# EAGLE design Microinverter (EAGLE 9.5.2)
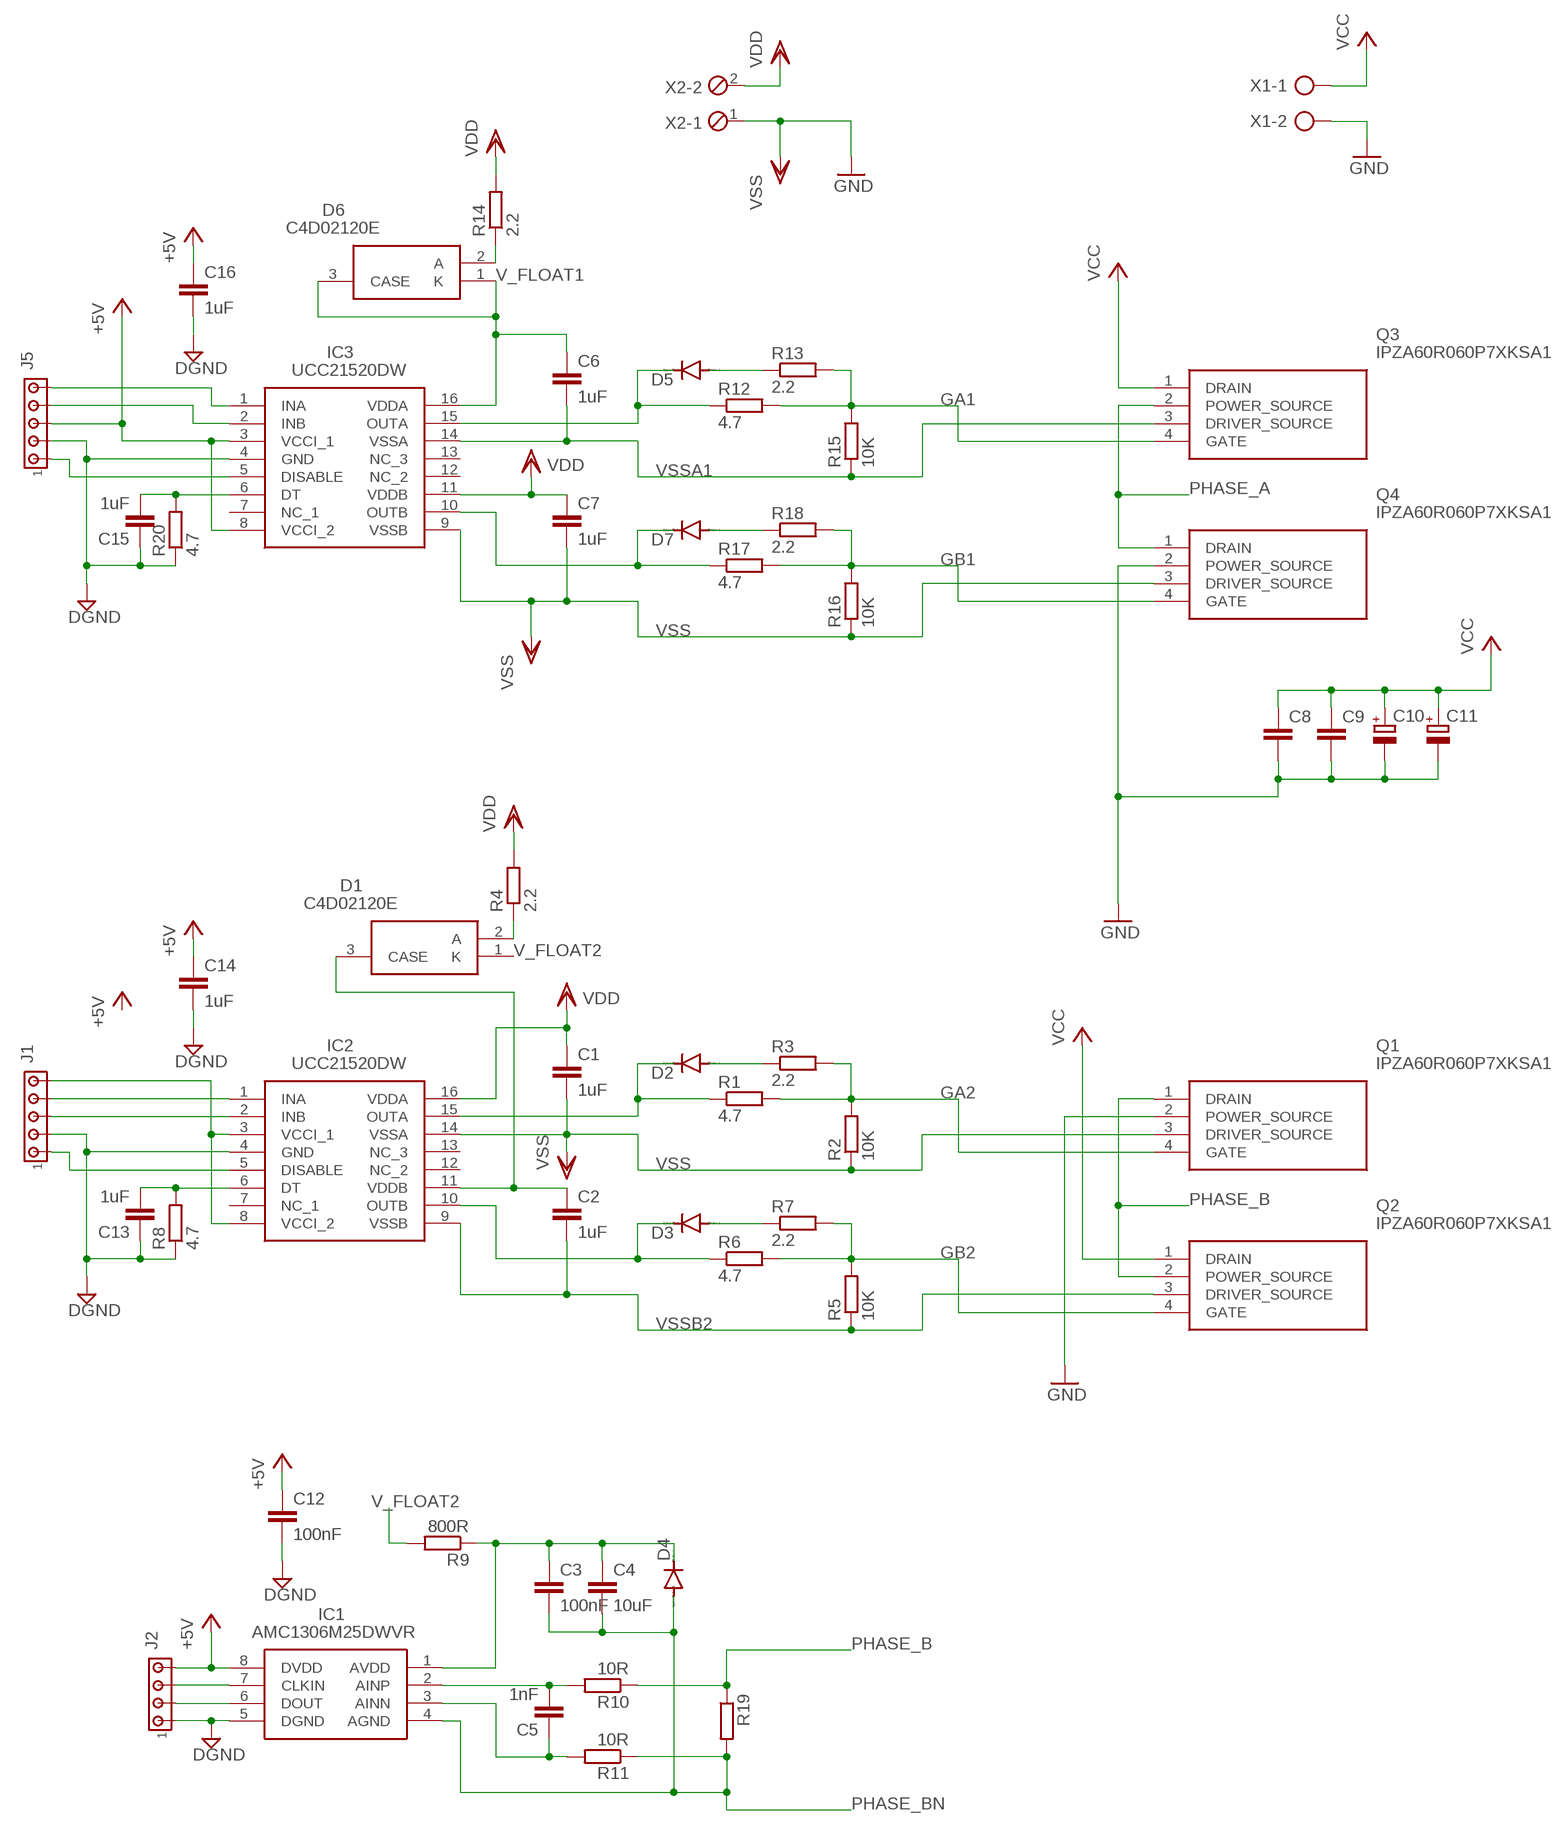
[diagram p0: schematic, sheet 1]

## Parts
C1  1uF  C-EUC0805  [C0805]
C2  1uF  C-EUC0805  [C0805]
C3  100nF  C-EUC0805  [C0805]
C4  10uF  C-EUC0805  [C0805]
C5  1nF  C-EUC0805  [C0805]
C6  1uF  C-EUC0805  [C0805]
C7  1uF  C-EUC0805  [C0805]
C8  C-EUC1210K  [C1210K]
C9  C-EUC1210K  [C1210K]
C10  CPOL-EUSANYO_H  [SANYO-OSCON_H]
C11  CPOL-EUSANYO_H  [SANYO-OSCON_H]
C12  100nF  C-EUC0805  [C0805]
C13  1uF  C-EUC0805  [C0805]
C14  1uF  C-EUC0805  [C0805]
C15  1uF  C-EUC0805  [C0805]
C16  1uF  C-EUC0805  [C0805]
D1  C4D02120E  [C3D06065E]
D2  MBR0520LT  [SOD123]
D3  MBR0520LT  [SOD123]
D4  MBR0520LT  [SOD123]
D5  MBR0520LT  [SOD123]
D6  C4D02120E  [C3D06065E]
D7  MBR0520LT  [SOD123]
IC1  AMC1306M25DWVR  [SOIC127P1150X280-8N]
IC2  UCC21520DW  [SOIC127P1030X265-16N]
IC3  UCC21520DW  [SOIC127P1030X265-16N]
J1  MTA05-100  [10X05MTA]
J2  MTA04-100  [10X04MTA]
J5  MTA05-100  [10X05MTA]
Q1  IPZA60R060P7XKSA1  [IPZA60R060P7XKSA1]
Q2  IPZA60R060P7XKSA1  [IPZA60R060P7XKSA1]
Q3  IPZA60R060P7XKSA1  [IPZA60R060P7XKSA1]
Q4  IPZA60R060P7XKSA1  [IPZA60R060P7XKSA1]
R1  4.7  R-EU_R0805  [R0805]
R2  10K  R-EU_R0805  [R0805]
R3  2.2  R-EU_R0805  [R0805]
R4  2.2  R-EU_R0805  [R0805]
R5  10K  R-EU_R0805  [R0805]
R6  4.7  R-EU_R0805  [R0805]
R7  2.2  R-EU_R0805  [R0805]
R8  4.7  R-EU_R0805  [R0805]
R9  800R  R-EU_R0805  [R0805]
R10  10R  R-EU_R0805  [R0805]
R11  10R  R-EU_R0805  [R0805]
R12  4.7  R-EU_R0805  [R0805]
R13  2.2  R-EU_R0805  [R0805]
R14  2.2  R-EU_R0805  [R0805]
R15  10K  R-EU_R0805  [R0805]
R16  10K  R-EU_R0805  [R0805]
R17  4.7  R-EU_R0805  [R0805]
R18  2.2  R-EU_R0805  [R0805]
R19  R-EU_R2512  [R2512]
R20  4.7  R-EU_R0805  [R0805]
X1  AK500/2  [AK500/2]
X2  MPT2  [2POL254]

## Nets
+5V: C12.1 C14.1 C16.1 IC1.8(DVDD) IC3.3(VCCI_1) IC3.8(VCCI_2) J2.4 J5.3
AVDD: C3.1 C4.1 D4.C IC1.1(AVDD) R9.1
CLKIN: IC1.7(CLKIN) J2.3
DGND: C12.2 C13.1 C14.2 C15.1 C16.2 IC1.5(DGND) IC2.4(GND) IC3.4(GND) J1.2 J2.1 J5.2 R8.1 R20.1
DOUT: IC1.6(DOUT) J2.2
GA1: Q3.4(GATE) R12.2 R13.2 R15.2
GA2: Q1.4(GATE) R1.2 R2.2 R3.2
GB1: Q4.4(GATE) R16.2 R17.2 R18.2
GB2: Q2.4(GATE) R5.2 R6.2 R7.2
GND: C8.2 C9.2 C10.- C11.- Q1.2(POWER_SOURCE) Q4.2(POWER_SOURCE) X1.2
N$1: D2.A R3.1
N$2: D3.A R7.1
N$3: C5.2 IC1.2(AINP) R10.2
N$4: D6.2(A) R14.1
N$5: D5.A R13.1
N$6: D7.A R18.1
N$7: D1.2(A) R4.1
N$8: C5.1 IC1.3(AINN) R11.2
N$9: IC2.1(INA) J1.4
N$10: C13.2 IC2.6(DT) R8.2
N$11: IC2.2(INB) J1.3
N$12: IC2.5(DISABLE) J1.1
N$13: C15.2 IC3.6(DT) R20.2
N$15: IC3.2(INB) J5.4
N$16: IC3.5(DISABLE) J5.1
N$17: IC2.3(VCCI_1) IC2.8(VCCI_2) J1.5
N$18: IC3.1(INA) J5.5
OUTA: D2.C IC2.15(OUTA) R1.1
OUTA1: D5.C IC3.15(OUTA) R12.1
OUTB1: D7.C IC3.10(OUTB) R17.1
P7: D3.C IC2.10(OUTB) R6.1
PHASE_A: Q3.2(POWER_SOURCE) Q4.1(DRAIN)
PHASE_B: Q1.1(DRAIN) Q2.2(POWER_SOURCE) R10.1 R19.1
PHASE_BN: C3.2 C4.2 D4.A IC1.4(AGND) R11.1 R19.2
V_FLOAT1: C6.1 D6.1(K) D6.3(CASE) IC3.16(VDDA)
V_FLOAT2: C2.1 D1.3(CASE) IC2.11(VDDB) R9.2
VCC: C8.1 C9.1 C10.+ C11.+ Q2.1(DRAIN) Q3.1(DRAIN) X1.1
VDD: C1.1 C7.1 IC2.16(VDDA) IC3.11(VDDB) R4.2 R14.2 X2.2
VSS: C1.2 C7.2 IC2.14(VSSA) IC3.9(VSSB) Q1.3(DRIVER_SOURCE) Q4.3(DRIVER_SOURCE) R2.1 R16.1 X2.1 ; supply symbol labelled GND
VSSA1: C6.2 IC3.14(VSSA) Q3.3(DRIVER_SOURCE) R15.1
VSSB2: C2.2 IC2.9(VSSB) Q2.3(DRIVER_SOURCE) R5.1
Unconnected: D1.1(K) IC2.7(NC_1) IC2.12(NC_2) IC2.13(NC_3) IC3.7(NC_1) IC3.12(NC_2) IC3.13(NC_3)

## Library data of the parts
C1-C9 C12-C16 = rcl:C-EU: CAPACITOR, European symbol; SPICEPREFIX: C
C10 C11 = rcl:CPOL-EU: POLARIZED CAPACITOR, European symbol; SPICEPREFIX: C
D1 D6 = SamacSys_Parts:C4D02120E: Wolfspeed C4D02120E, SMT SiC Schottky Diode, 1200V 4.5A, 3-Pin TO-252 Source: Datasheet <https://www.wolfspeed.com/media/downloads/128/C4D02120E.pdf>; DESCRIPTION: Wolfspeed C4D02120E, SMT SiC Schottky Diode, 1200V 4.5A, 3-Pin TO-252; HEIGHT: 2mm; MANUFACTURER_NAME: Wolfspeed; MANUFACTURER_PART_NUMBER: C4D02120E
D2-D5 D7 = diode:MBR0520LT: SCHOTTKY BARRIER RECTIFIER Source: http://onsemi.com .. MBR0520LT1-D.pdf
IC1 = SamacSys_Parts:AMC1306M25DWVR: Small reinforced isolated modulator with +/-250-mV input and CMOS interface Source: Datasheet <http://www.ti.com/lit/gpn/amc1306m25>; DESCRIPTION: Small reinforced isolated modulator with +/-250-mV input and CMOS interface; HEIGHT: 2.8mm; MANUFACTURER_NAME: Texas Instruments; MANUFACTURER_PART_NUMBER: AMC1306M25DWVR; MOUSER_PART_NUMBER: 595-AMC1306M25DWVR; MOUSER_PRICE-STOCK: https://www.mouser.co.uk/ProductDetail/Texas-Instruments/AMC1306M25DWVR?qs=AQlKX63v8RujvxjVQGujTw%3D%3D
IC2 IC3 = SamacSys_Parts:UCC21520DW: Gate Drivers 4A/6A, 5.7 kVrms Isolated Dual Channel Gate Driver 16-SOIC -40 to 125 Source: Datasheet <http://www.tij.co.jp/jp/lit/ds/symlink/ucc21520.pdf>; DESCRIPTION: Gate Drivers 4A/6A, 5.7 kVrms Isolated Dual Channel Gate Driver 16-SOIC -40 to 125; HEIGHT: 2.65mm; MANUFACTURER_NAME: Texas Instruments; MANUFACTURER_PART_NUMBER: UCC21520DW; MOUSER_PART_NUMBER: 595-UCC21520DW; MOUSER_PRICE-STOCK: https://www.mouser.co.uk/ProductDetail/Texas-Instruments/UCC21520DW?qs=zEmsApcVOkX3g4f0E3%252BNKw%3D%3D
J1 J5 = con-amp:MTA05-100: AMP connector
J2 = con-amp:MTA04-100: AMP connector
Q1-Q4 = SamacSys_Parts:IPZA60R060P7XKSA1: INFINEON - IPZA60R060P7XKSA1 - MOSFET, N-CH, 600V, 48A, TO-247 Source: Datasheet <https://www.infineon.com/dgdl/Infineon-IPZA60R060P7-DS-v02_01-EN.pdf?fileId=5546d462602a9dc80160316b71ad645f>; DESCRIPTION: INFINEON - IPZA60R060P7XKSA1 - MOSFET, N-CH, 600V, 48A, TO-247; HEIGHT: 5mm; MANUFACTURER_NAME: Infineon; MANUFACTURER_PART_NUMBER: IPZA60R060P7XKSA1; MOUSER_PART_NUMBER: 726-IPZA60R060P7XKSA; MOUSER_PRICE-STOCK: https://www.mouser.co.uk/ProductDetail/Infineon-Technologies/IPZA60R060P7XKSA1?qs=xhbEVWpZdWfJmPStSJ0kFw%3D%3D
R1-R20 = rcl:R-EU_: RESISTOR, European symbol; SPICEPREFIX: R
X1 = con-ptr500:AK500/2: CONNECTOR; OC_FARNELL: unknown; OC_NEWARK: unknown
X2 = con-phoenix-254:MPT2: PHOENIX CONNECTOR; OC_FARNELL: unknown; OC_NEWARK: unknown

## Board
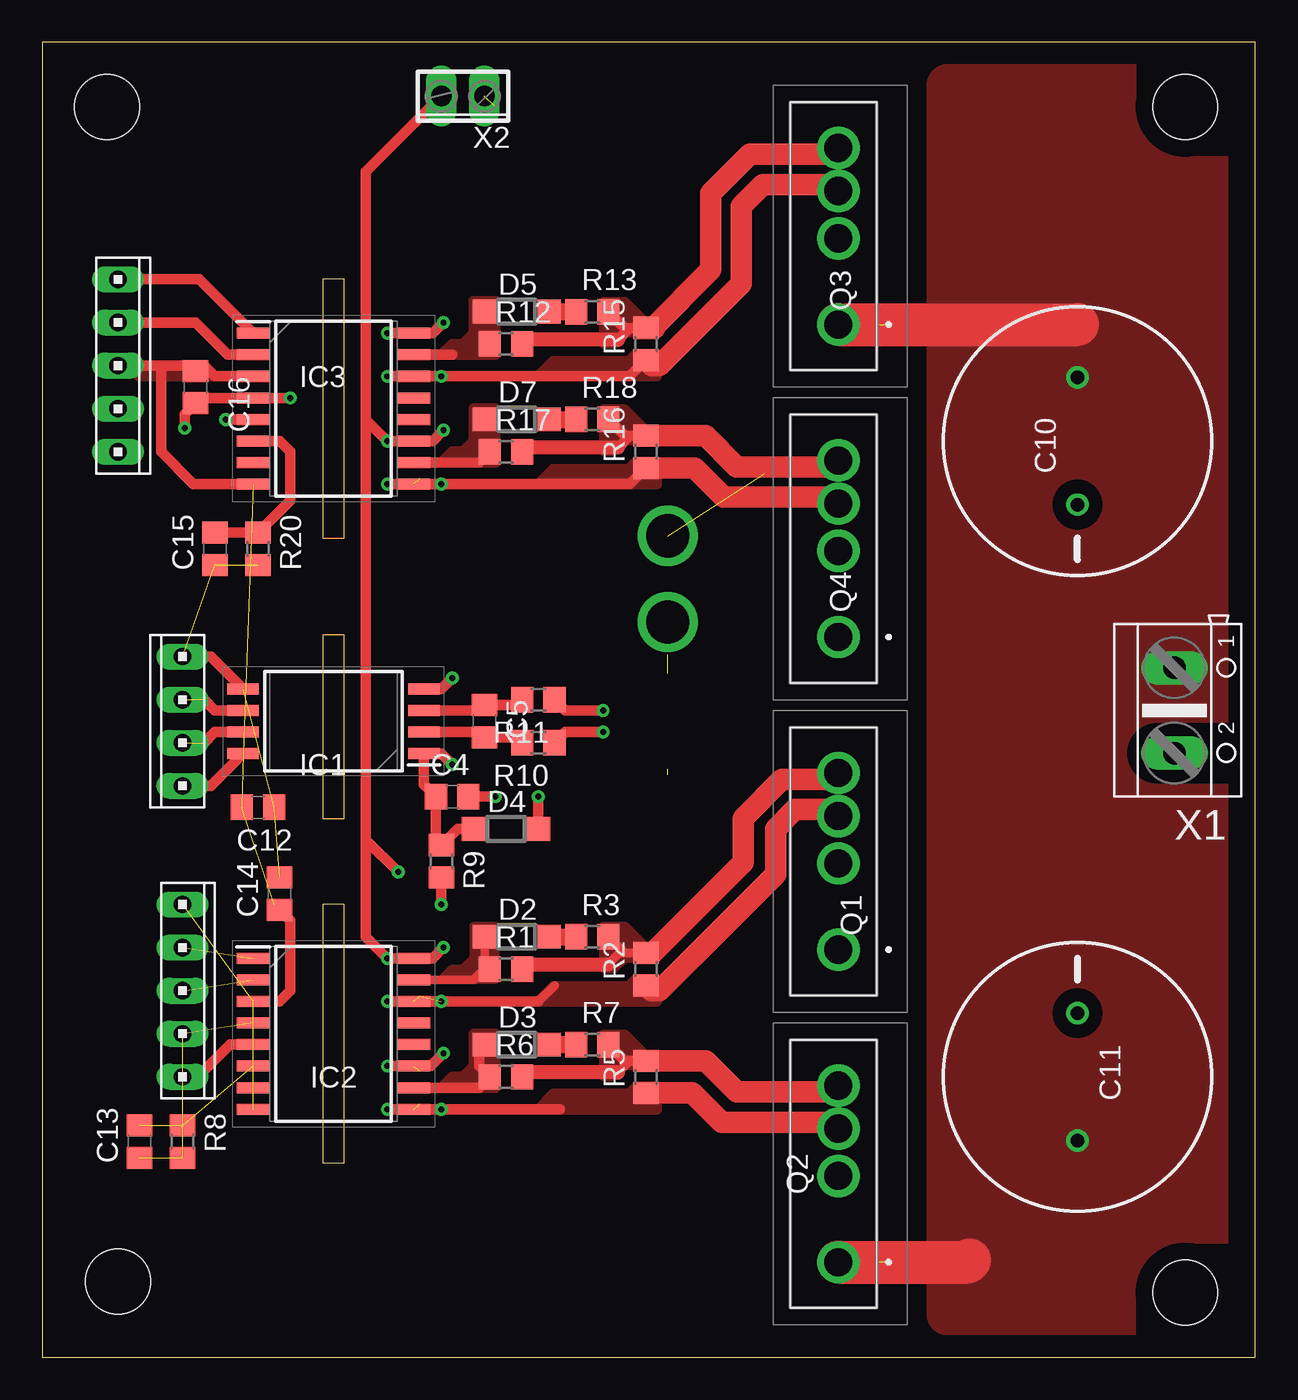
[diagram p1: board, top side]
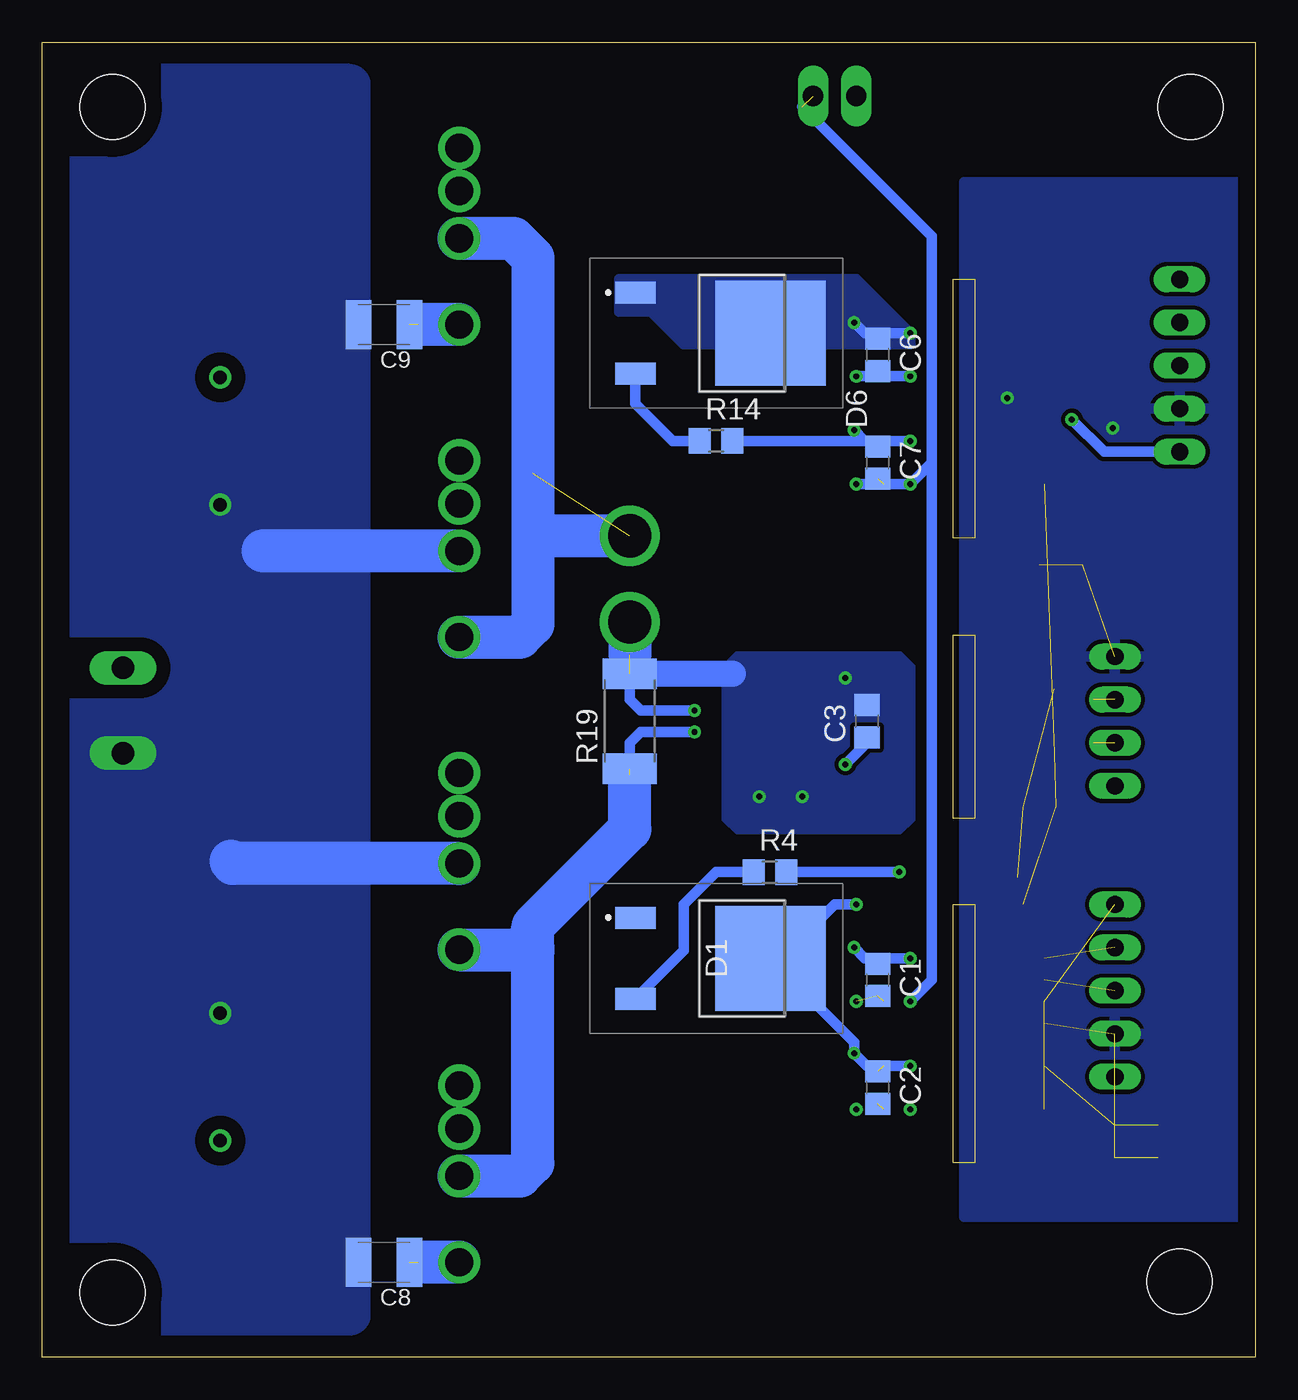
[diagram p2: board, bottom side, seen from below]

Size 71.42 x 77.46 mm. Coordinates in mm from the lower left corner, seen from the top.
Outline: 0,0 71.42,0 71.42,77.46 0,77.46 0,0
Copper layers (1*16): Top 0.035mm / dielectric 1.5mm / Bottom 0.035mm
Design rules "default *": minimum track width 6mil, minimum drill 0.35mm, track to track 10mil, track to pad 10mil, pad to pad 10mil, via to via 10mil, smd to smd 6mil, copper to edge 40mil, drill to drill 6mil, minimum pad ring 10mil, minimum via ring 8mil, stop-mask expansion 4mil, vias tented up to drill 0mil, thermal gap 10mil
Holes 3.81 mm at 3.81,73.66 67.31,73.66 67.31,3.81 4.45,4.45
Milling: area 16.5,11.4 to 17.8,26.7; area 16.5,31.8 to 17.8,42.5; area 16.5,48.3 to 17.8,63.5

### Footprints (pad centres in the part's own frame; a part is rotated, then mirrored left to right if it is on the bottom)
C0805 = smd 1.3 x 1.5: 1 -0.95,0; 2 0.95,0
C1210K = smd 1.5 x 2.9: 1 -1.5,0; 2 1.5,0
SANYO-OSCON_H = drill 0.8 pad 1.27: + 3.75,0; - -3.75,0
C3D06065E = smd 1.3 x 2.4: 1 -2.39,-4.75; 2 2.39,-4.75 | smd 6.2 x 6.5: 3 0,3.2
SOD123 = smd 1.4 x 1.4: A 1.9,0; C -1.9,0
SOIC127P1150X280-8N = smd 1.85 x 0.65: 1 -5.325,1.905; 2 -5.325,0.635; 3 -5.325,-0.635; 4 -5.325,-1.905; 5 5.325,-1.905; 6 5.325,-0.635; 7 5.325,0.635; 8 5.325,1.905
SOIC127P1030X265-16N = smd 1.95 x 0.65: 1 -4.725,4.445; 2 -4.725,3.175; 3 -4.725,1.905; 4 -4.725,0.635; 5 -4.725,-0.635; 6 -4.725,-1.905; 7 -4.725,-3.175; 8 -4.725,-4.445; 9 4.725,-4.445; 10 4.725,-3.175; 11 4.725,-1.905; 12 4.725,-0.635; 13 4.725,0.635; 14 4.725,1.905; 15 4.725,3.175; 16 4.725,4.445
10X05MTA = drill 1.016 long: 1 5.08,0; 2 2.54,0; 3 0,0; 4 -2.54,0; 5 -5.08,0
10X04MTA = drill 1.016 long: 1 3.81,0; 2 1.27,0; 3 -1.27,0; 4 -3.81,0
IPZA60R060P7XKSA1 = drill 1.66 pad 2.49: 1 -5.205,0.11; 2 -0.125,0.11; 3 2.665,0.11; 4 5.205,0.11
R0805 = smd 1.3 x 1.5: 1 -0.95,0; 2 0.95,0
R2512 = smd 1.8 x 3.2: 1 -2.8,0; 2 2.8,0
AK500/2 = drill 1.321 long: 1 -2.515,0; 2 2.515,0
2POL254 = drill 1.2 long: 1 -1.27,0; 2 1.27,0

### Placement (x,y rotation side)
C1  22.23,22.23 270 bottom
C2  22.23,15.88 270 bottom
C3  22.86,37.46 90 bottom
C4  24.13,33.02 0 top
C5  26.03,37.46 270 top
C6  22.23,59.05 270 bottom
C7  22.23,52.7 270 bottom
C8  51.31,5.59 180 bottom
C9  51.31,60.83 180 bottom
C10  60.96,53.97 90 top
C11  60.96,16.51 270 top
C12  12.7,32.38 0 top
C13  5.71,12.7 90 top
C14  13.97,27.3 90 top
C15  10.16,47.62 90 top
C16  9.02,57.15 270 top
D1  31.75,23.5 270 bottom
D2  27.94,24.77 0 top
D3  27.94,18.41 0 top
D4  27.3,31.11 0 top
D5  27.94,61.59 0 top
D6  31.75,60.32 270 bottom
D7  27.94,55.24 0 top
IC1  17.15,37.46 180 top
IC2  17.15,19.05 0 top
IC3  17.15,55.88 0 top
J1  8.26,21.59 270 top
J2  8.26,37.46 90 top
J5  4.45,58.42 270 top
Q1  46.99,29.21 90 top
Q2  46.99,10.79 90 top
Q3  46.99,66.04 90 top
Q4  46.99,47.62 90 top
R1  27.3,22.86 0 top
R2  35.56,22.86 90 top
R3  32.39,24.77 0 top
R4  28.58,28.57 0 bottom
R5  35.56,16.51 90 top
R6  27.3,16.51 0 top
R7  32.39,18.41 0 top
R8  8.26,12.7 90 top
R9  23.49,29.21 270 top
R10  29.21,36.2 180 top
R11  29.21,38.73 180 top
R12  27.3,59.69 0 top
R13  32.39,61.59 0 top
R14  31.75,53.97 0 bottom
R15  35.56,59.69 90 top
R16  35.56,53.34 90 top
R17  27.3,53.34 0 top
R18  32.39,55.24 0 top
R19  36.83,37.46 90 bottom
R20  12.7,47.62 90 top
X1  66.67,38.1 270 top
X2  24.77,74.3 180 top

### Tracks (layer width: path | path; a pad name or v marks a point on that pad's centre or on a via)
+5V  (3 unrouted)
  Top 0.61: IC1.8 9.91,33.65 J2.4 6.98,33.65 | 13.65,26.67 C14.1 14.6,25.72 14.6,21.59 13.97,20.96 | IC3.3 10.16,57.78 9.53,58.42 6.98,58.42 | 6.98,58.42 J5.3 | 6.98,58.42 6.98,53.34 8.89,51.43 IC3.8
  pour Top (no thermals): 10.16,57.78 9.53,58.42 5.08,58.42 5.71,57.78
AVDD  (via drill 0.35)
  Top 0.61: D4.C 24.45,31.11 R9.1 23.18,30.48 C4.1 22.47,33.73 IC1.1 23.49,35.56 v24.13,34.92
  Bottom 0.61: C3.1 22.86,36.2 v24.13,34.92
CLKIN  (1 unrouted)
  Top 0.61: IC1.7 10.16,36.83 9.53,36.2
DGND  (via drill 0.35)  (7 unrouted)
  Top 0.61: IC1.5 9.91,41.27 J2.1 7.3,41.27 | v14.6,56.51 IC3.4 9.33,56.51 C16.2 8.38,55.56 v8.38,54.74
  pour Bottom: 0.63,69.22 17.15,69.22 17.15,8.26 1.27,8.26 0.63,8.26
DOUT  (1 unrouted)
  Top 0.61: IC1.6 10.16,38.1 9.53,38.73
GA1
  Top 0.61: R12.2 28.51,59.94 | 33.91,59.94 34.61,60.64 R15.2 34.29,60.64 R13.2
  Top 0.813: 33.91,59.94 28.51,59.94
  Top 1.27: 36.07,60.64 R15.2 35.94,60.64 39.37,64.07 39.37,68.58 41.65,70.86 46.5,70.86 Q3.4
  pour Top (no thermals): 33.02,62.23 34.29,62.23 35.56,60.96 36.2,60.96 36.2,60.32 34.29,60.32 33.66,59.69 33.02,59.69
GA2
  Top 0.508: R1.2 28.51,23.11 | 33.27,23.11 33.97,23.81 R2.2 34.29,23.81 R3.2
  Top 0.813: 33.27,23.11 28.51,23.11
  Top 1.27: R2.2 35.94,23.81 41.27,29.14 41.27,31.75 43.56,34.03 46.5,34.03 Q1.4
  pour Top (no thermals): 33.02,25.4 34.29,25.4 35.56,24.13 36.2,24.13 36.2,23.5 34.29,23.5 33.66,22.86 33.02,22.86
GB1
  Top 0.61: R17.2 28.51,53.59 | 33.91,53.59 34.61,54.29 R16.2 34.29,54.29 R18.2
  Top 0.813: 33.91,53.59 28.51,53.59
  Top 1.27: Q4.4 46.5,52.45 40.9,52.45 39.05,54.29 R16.2
  pour Top (no thermals): 33.02,55.88 34.29,55.88 35.56,54.61 36.2,54.61 36.2,53.97 34.29,53.97 33.66,53.34 33.02,53.34
GB2
  Top 0.508: R6.2 28.51,16.76 | 33.91,16.76 34.61,17.46
  Top 0.61: R5.2 34.61,17.46 34.29,17.46 R7.2
  Top 0.813: 33.91,16.76 28.51,16.76
  Top 1.27: Q2.4 46.5,15.62 40.9,15.62 39.05,17.46 R5.2
  pour Top (no thermals): 33.02,19.05 34.29,19.05 35.56,17.78 36.2,17.78 36.2,17.14 34.29,17.14 33.66,16.51 33.02,16.51
GND
  Bottom 2.54: Q4.2 58.42,47.5 | Q1.2 60.2,29.09 60.33,29.21
  pour Bottom (isolate 0.813, no thermals): 53.34,74.93 68.58,74.93 68.58,2.54 53.34,2.54
N$1
  Top 1.016: D2.A R3.1
N$2
  Top 1.016: D3.A R7.1
N$3
  Top 0.61: IC1.2 25.72,36.83 C5.2 27.94,36.51 R10.2
N$4
  Bottom 0.61: R14.1 34.29,53.97 36.5,56.18 D6.2
N$5
  Top 1.016: D5.A R13.1
N$6
  Top 1.016: D7.A R18.1
N$7
  Bottom 0.61: D1.2 33.66,23.95 33.66,26.67 31.75,28.57 R4.1
N$8
  Top 0.61: IC1.3 25.72,38.1 C5.1 27.94,38.41 R11.2
N$9  (1 unrouted)
N$10  (2 unrouted)
N$11  (1 unrouted)
N$12
  Top 0.61: IC2.5 11.05,18.41 9.14,16.51 J1.1
N$13
  Top 0.61: IC3.6 13.97,53.97 14.6,53.34 14.6,50.48 R20.2 C15.2
N$15
  Top 0.61: J5.4 9.02,60.96 10.92,59.05 IC3.2
N$16  (via drill 0.35)
  Top 0.61: IC3.5 v10.79,55.24
  Bottom 0.61: v10.79,55.24 8.89,53.34 J5.1
N$17  (2 unrouted)
N$18
  Top 0.61: IC3.1 9.24,63.5 J5.5
OUTA
  Top 0.508: D2.C 26.04,22.87 25.4,22.23 IC2.15
  pour Top (no thermals): 26.67,22.23 26.67,25.4 25.4,25.4 25.4,23.5 24.77,22.86 24.13,22.86 23.49,22.23
OUTA1
  Top 0.61: IC3.15 24.13,59.05
  pour Top (no thermals): 23.49,59.05 24.13,59.69 24.77,59.69 25.4,60.32 25.4,62.23 26.67,62.23 26.67,59.05
OUTB1
  Top 0.61: IC3.10 25.72,52.7
  pour Top (no thermals): 23.49,52.7 24.13,53.34 24.77,53.34 25.4,53.97 25.4,55.88 26.67,55.88 26.67,52.7
P7
  Top 0.61: IC2.10 25.72,15.88 R6.1 25.72,17.14 25.72,18.09 D3.C
  pour Top (no thermals): 23.49,15.88 24.13,16.51 24.77,16.51 25.4,17.14 25.4,19.05 26.67,19.05 26.67,15.88
PHASE_A  (via drill 2.54)  (1 unrouted)
  Bottom 2.54: Q3.2 43.69,65.92 42.55,64.77 42.55,47.62 | Q4.1 43.3,42.42 42.55,43.18 42.55,47.62 | 42.55,53.97 42.55,52.07 | v36.83,48.39 41.78,48.39 42.55,47.62
PHASE_B  (via drill 0.35)  (1 unrouted)
  Top 0.61: v33.02,36.83 30.8,36.83 R10.1
  Bottom 0.61: v33.02,36.83 36.2,36.83 36.83,36.2 R19.1
  Bottom 2.54: Q2.2 43.3,10.67 42.55,11.43 42.55,23.88 42.67,24 | 43.69,24 Q1.1 42.67,24 | 42.67,24 42.55,24.13 42.55,25.4 36.83,31.11 36.83,34.29
PHASE_BN  (via drill 0.35, 2.54)  (1 unrouted)
  Top 0.61: v24.13,40 23.49,39.37 IC1.4 | C4.2 v26.67,33.02 | D4.A v29.2,33.01 v29.21,33.02 | R11.1 30.8,38.1 v33.02,38.1
  Bottom 0.61: v33.02,38.1 36.2,38.1 36.83,38.73 R19.2 | 30.74,40.26 30.48,40
  Bottom 1.524: R19.2 30.74,40.26
  Bottom 2.54: v36.83,43.31 36.83,41.4
  pour Bottom (no thermals): 20.95,31.11 30.48,31.11 31.12,31.75 31.12,40.64 30.48,41.27 20.95,41.27 20.32,40.64 20.32,31.75
V_FLOAT1  (via drill 0.35)
  Top 0.61: v23.62,60.96 22.99,60.32 IC3.16 v20.32,60.32
  Bottom 0.61: v20.32,60.32 21.91,60.32 | 21.91,60.32 C6.1 | v23.62,60.96 22.99,60.32 21.91,60.32
  pour Bottom (no thermals): 20.32,59.69 33.66,59.69 35.56,61.59 37.47,61.59 37.47,63.5 23.49,63.5 20.32,60.32
V_FLOAT2  (via drill 0.35)  (1 unrouted)
  Top 0.61: v20.32,17.14 IC2.11 22.86,17.14 v23.62,17.91 | R9.2 v23.49,26.67
  Bottom 0.61: v20.32,17.14 22.86,17.14 v23.62,17.91 23.62,18.54 28.55,23.47 D1.3 26.67,23.5 26.03,24.13 26.03,25.4 24.77,26.67 v23.49,26.67
VCC  (2 unrouted)
  Top 2.54: Q3.1 60.96,60.83 | Q2.1 54.48,5.59 54.61,5.71
  Bottom 2.54: Q2.1 49.27,5.59 49.28,5.59 | Q3.1 49.27,60.83 49.28,60.83
  pour Top (isolate 0.813, no thermals): 53.34,74.93 68.58,74.93 68.58,2.54 53.34,2.54
VDD  (via drill 0.35)
  Top 0.61: v23.62,54.61 22.99,53.97 IC3.11 v20.32,53.97 19.05,55.24 | 19.05,30.48 19.05,24.77 v20.32,23.5 IC2.16 22.99,23.5 v23.62,24.13 | X2.2 19.05,69.85 19.05,55.24 | v20.95,28.57 19.05,30.48 | 19.05,55.24 19.05,30.48
  Bottom 0.61: R14.2 22.55,53.97 C7.1 21.91,53.97 | v20.32,53.97 21.91,53.97 | v23.62,54.61 22.99,53.97 21.91,53.97 | C1.1 22.23,23.5 | v20.32,23.5 22.23,23.5 | 26.03,28.57 R4.2 v20.95,28.57 | v23.62,24.13 22.99,23.5 22.23,23.5
VSS  (via drill 0.35)  (4 unrouted)
  Top 0.508: 29.21,20.96 30.16,21.91
  Top 0.61: R16.1 34.61,51.43 v23.49,51.43 IC3.9 v20.32,51.43 | 29.21,20.96 v23.49,20.96 v20.32,20.96
  Top 1.27: Q1.3 46.5,32.26 44.32,32.26 43.18,31.11 43.18,28.45 36.32,21.59 35.88,21.59 R2.1 | Q4.3 46.5,50.67 40.13,50.67 38.41,52.39 R16.1
  Bottom 0.61: v23.49,51.43 v20.32,51.43 19.05,52.7 | 26.67,73.66 19.05,66.04 19.05,52.7 | v20.32,20.96 19.05,22.23 19.05,52.7
  pour Top (no thermals): 29.21,51.43 36.2,51.43 36.2,52.7 34.93,52.7 34.54,52.32 30.1,52.32
  pour Top (no thermals): 29.21,20.96 36.2,20.96 36.2,22.23 34.93,22.23 34.54,21.84 30.1,21.84
VSSA1  (via drill 0.35)
  Top 0.61: R15.1 34.61,57.78 v23.49,57.78 IC3.14 v20.32,57.78
  Top 1.27: Q3.3 46.5,69.09 42.42,69.09 41.15,67.82 41.15,63.25 36.32,58.42 35.88,58.42 R15.1
  Bottom 0.61: v20.32,57.78 21.91,57.78 | 21.91,57.78 C6.2 | v23.49,57.78 21.91,57.78
  pour Top (no thermals): 29.21,57.78 36.2,57.78 36.2,59.05 34.93,59.05 34.54,58.67 30.1,58.67
VSSB2  (via drill 0.35)  (1 unrouted)
  Top 0.61: v20.32,14.61 IC2.9 v23.49,14.61 30.48,14.61
  Top 1.27: R5.1 38.29,15.56 40.01,13.84 46.5,13.84 Q2.3
  pour Top (no thermals): 29.21,14.61 36.2,14.61 36.2,15.88 34.93,15.88 34.54,15.49 30.1,15.49